# EAGLE schematic tablet (EAGLE 8.4.3)
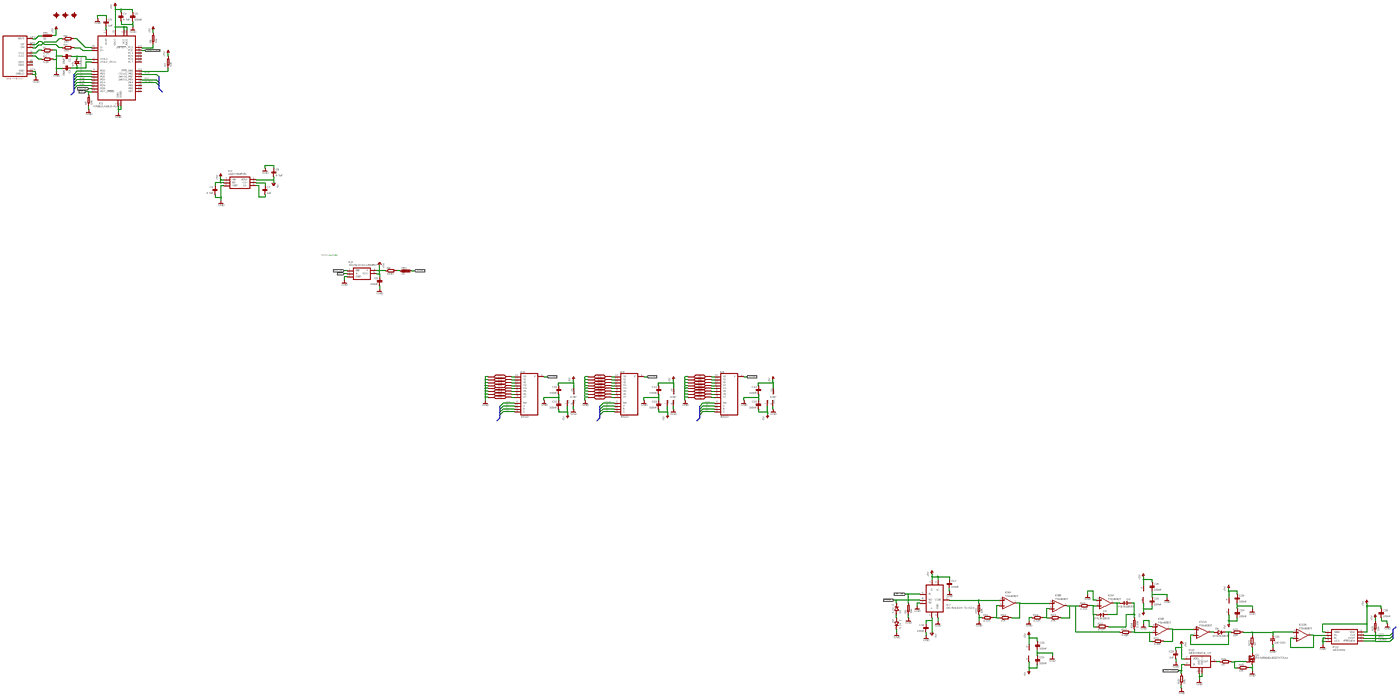
[diagram p0: schematic, sheet 1, overview]
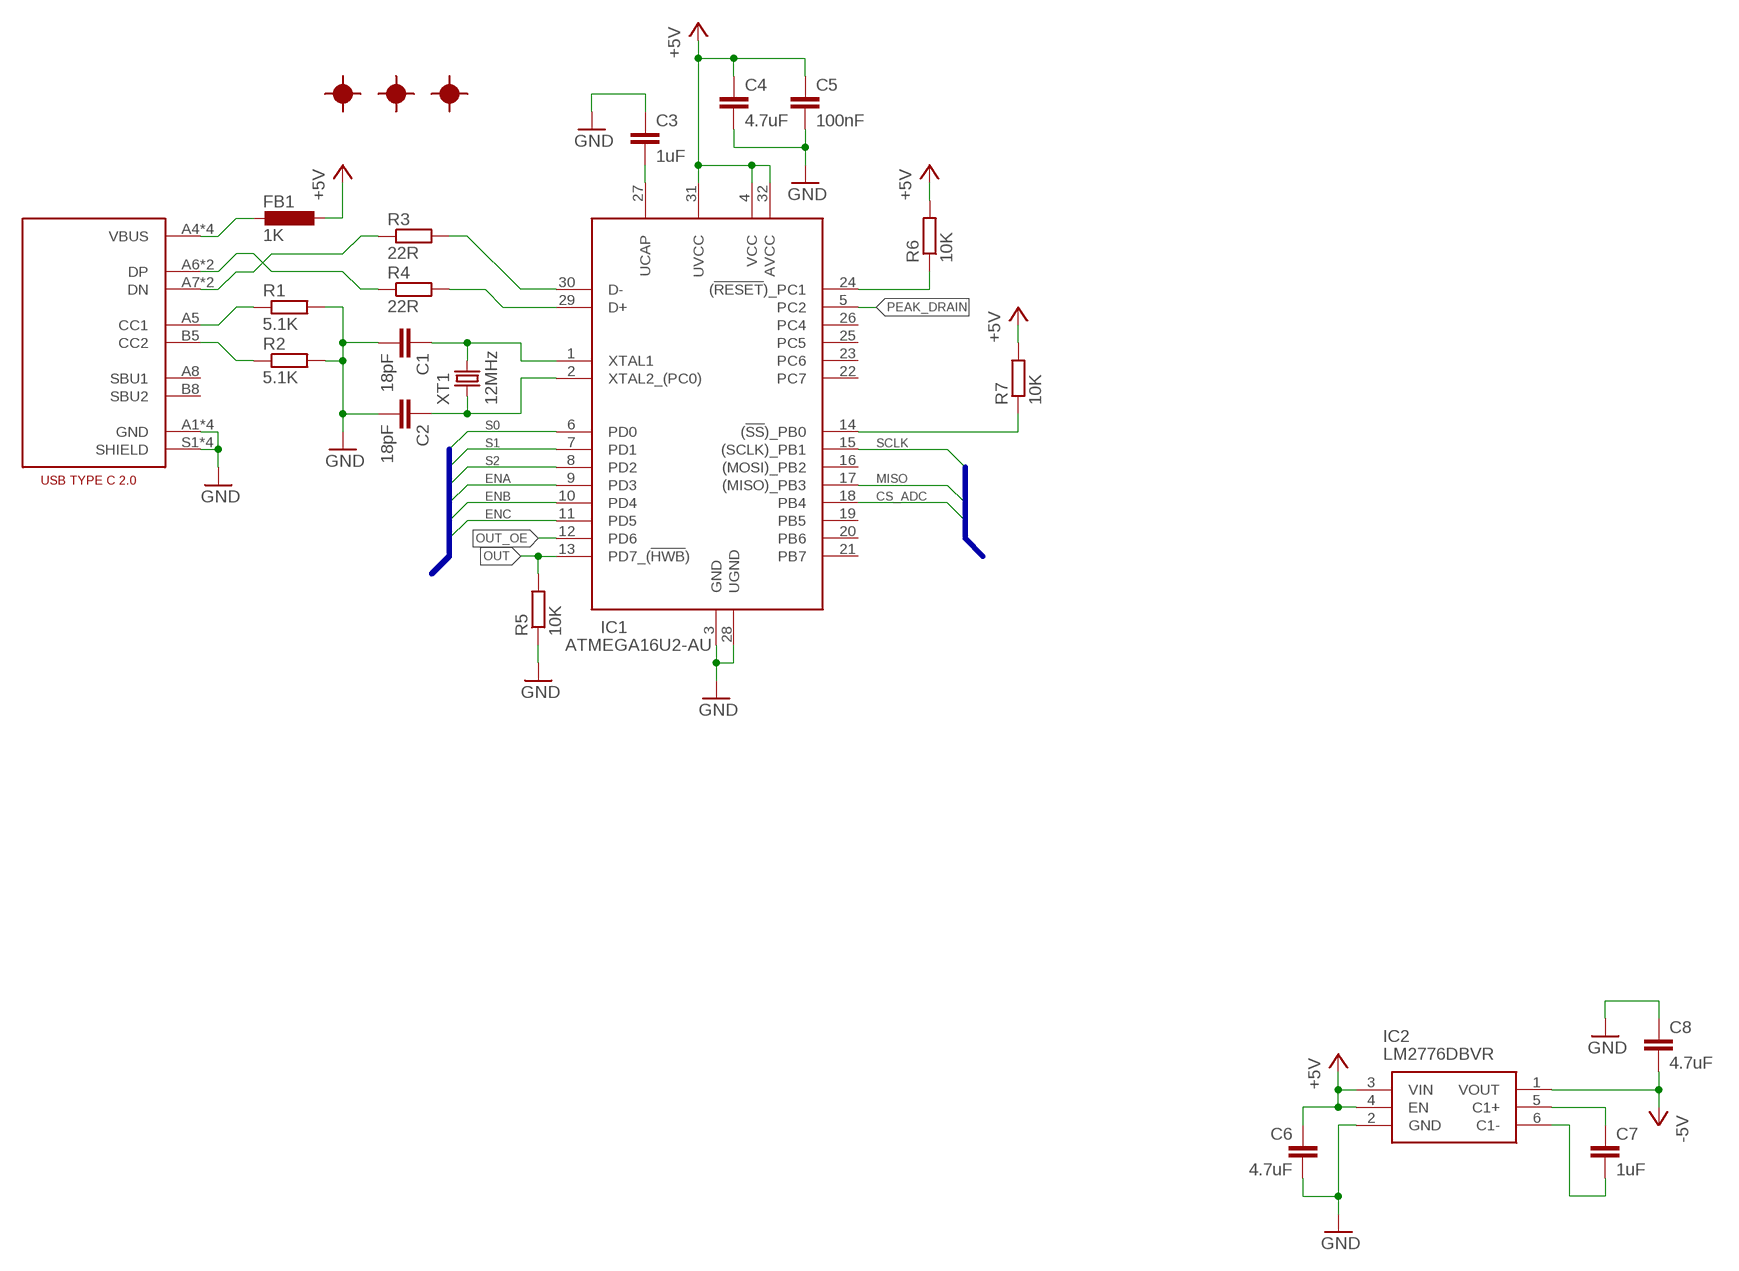
[diagram p1: schematic, sheet 1, part 1 of 4]
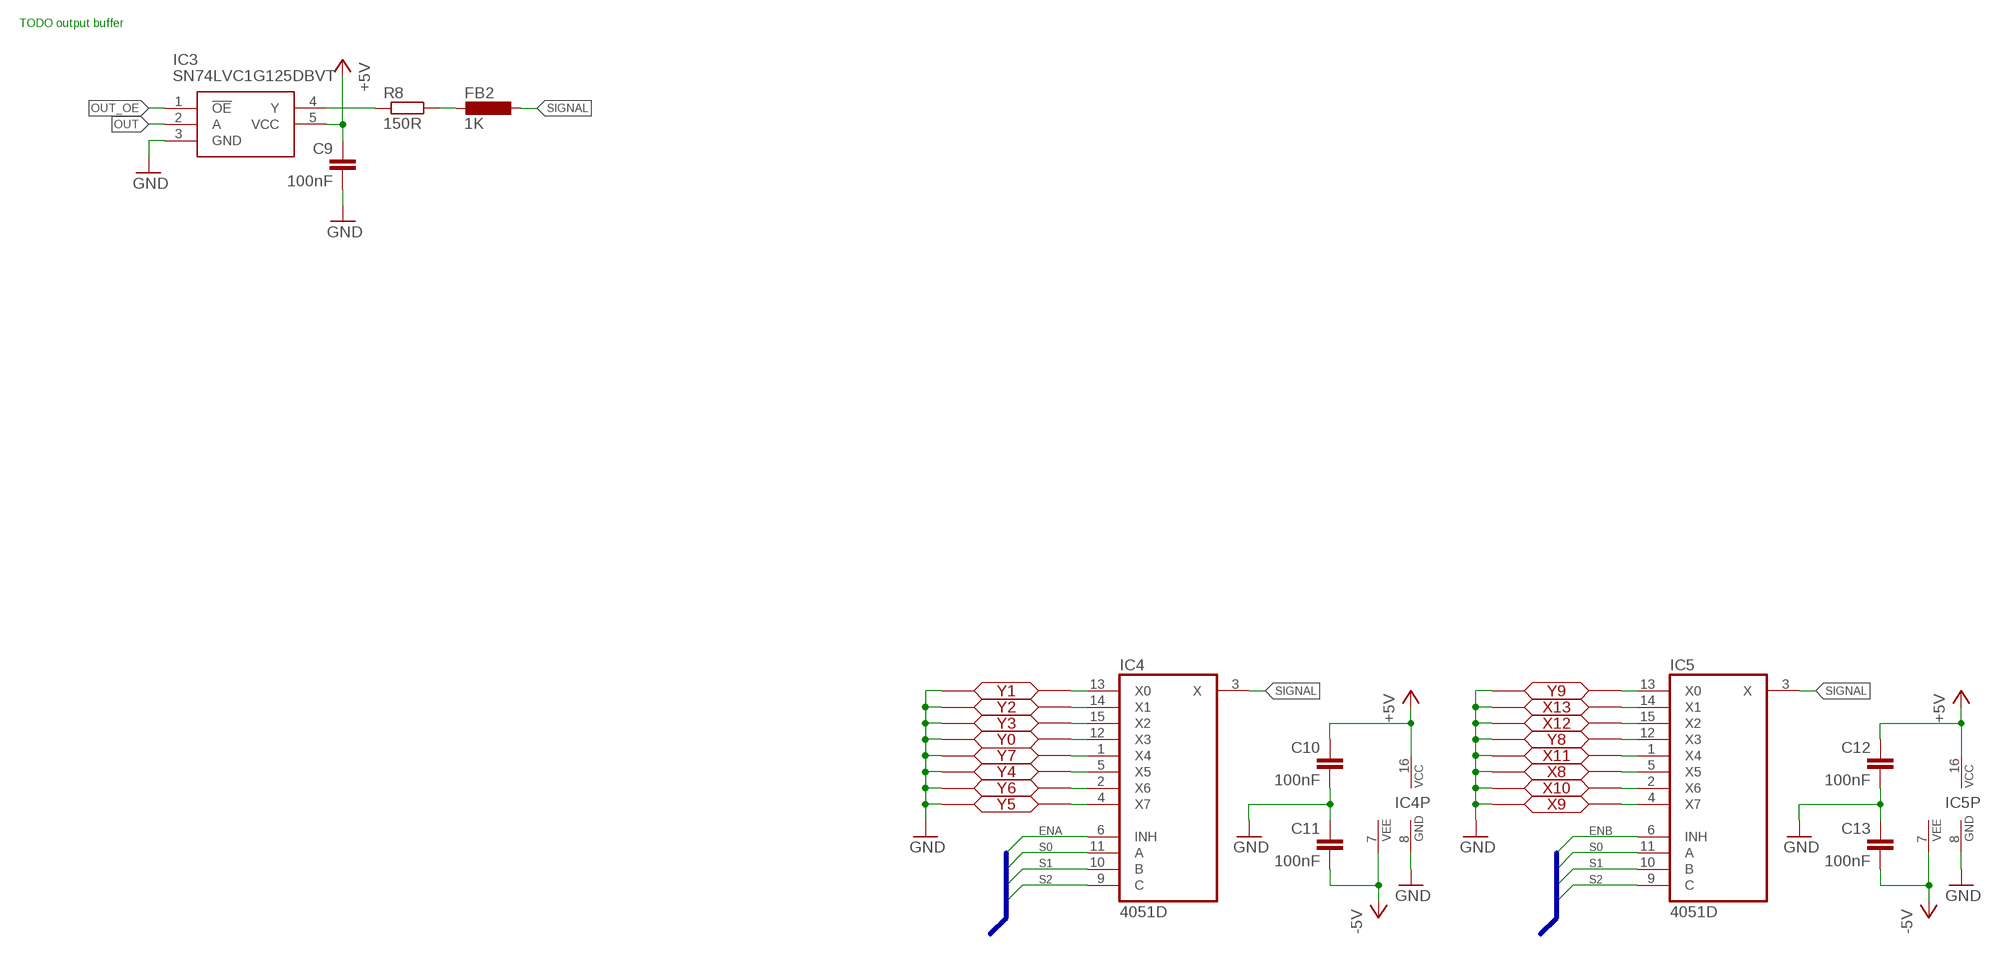
[diagram p2: schematic, sheet 1, part 2 of 4]
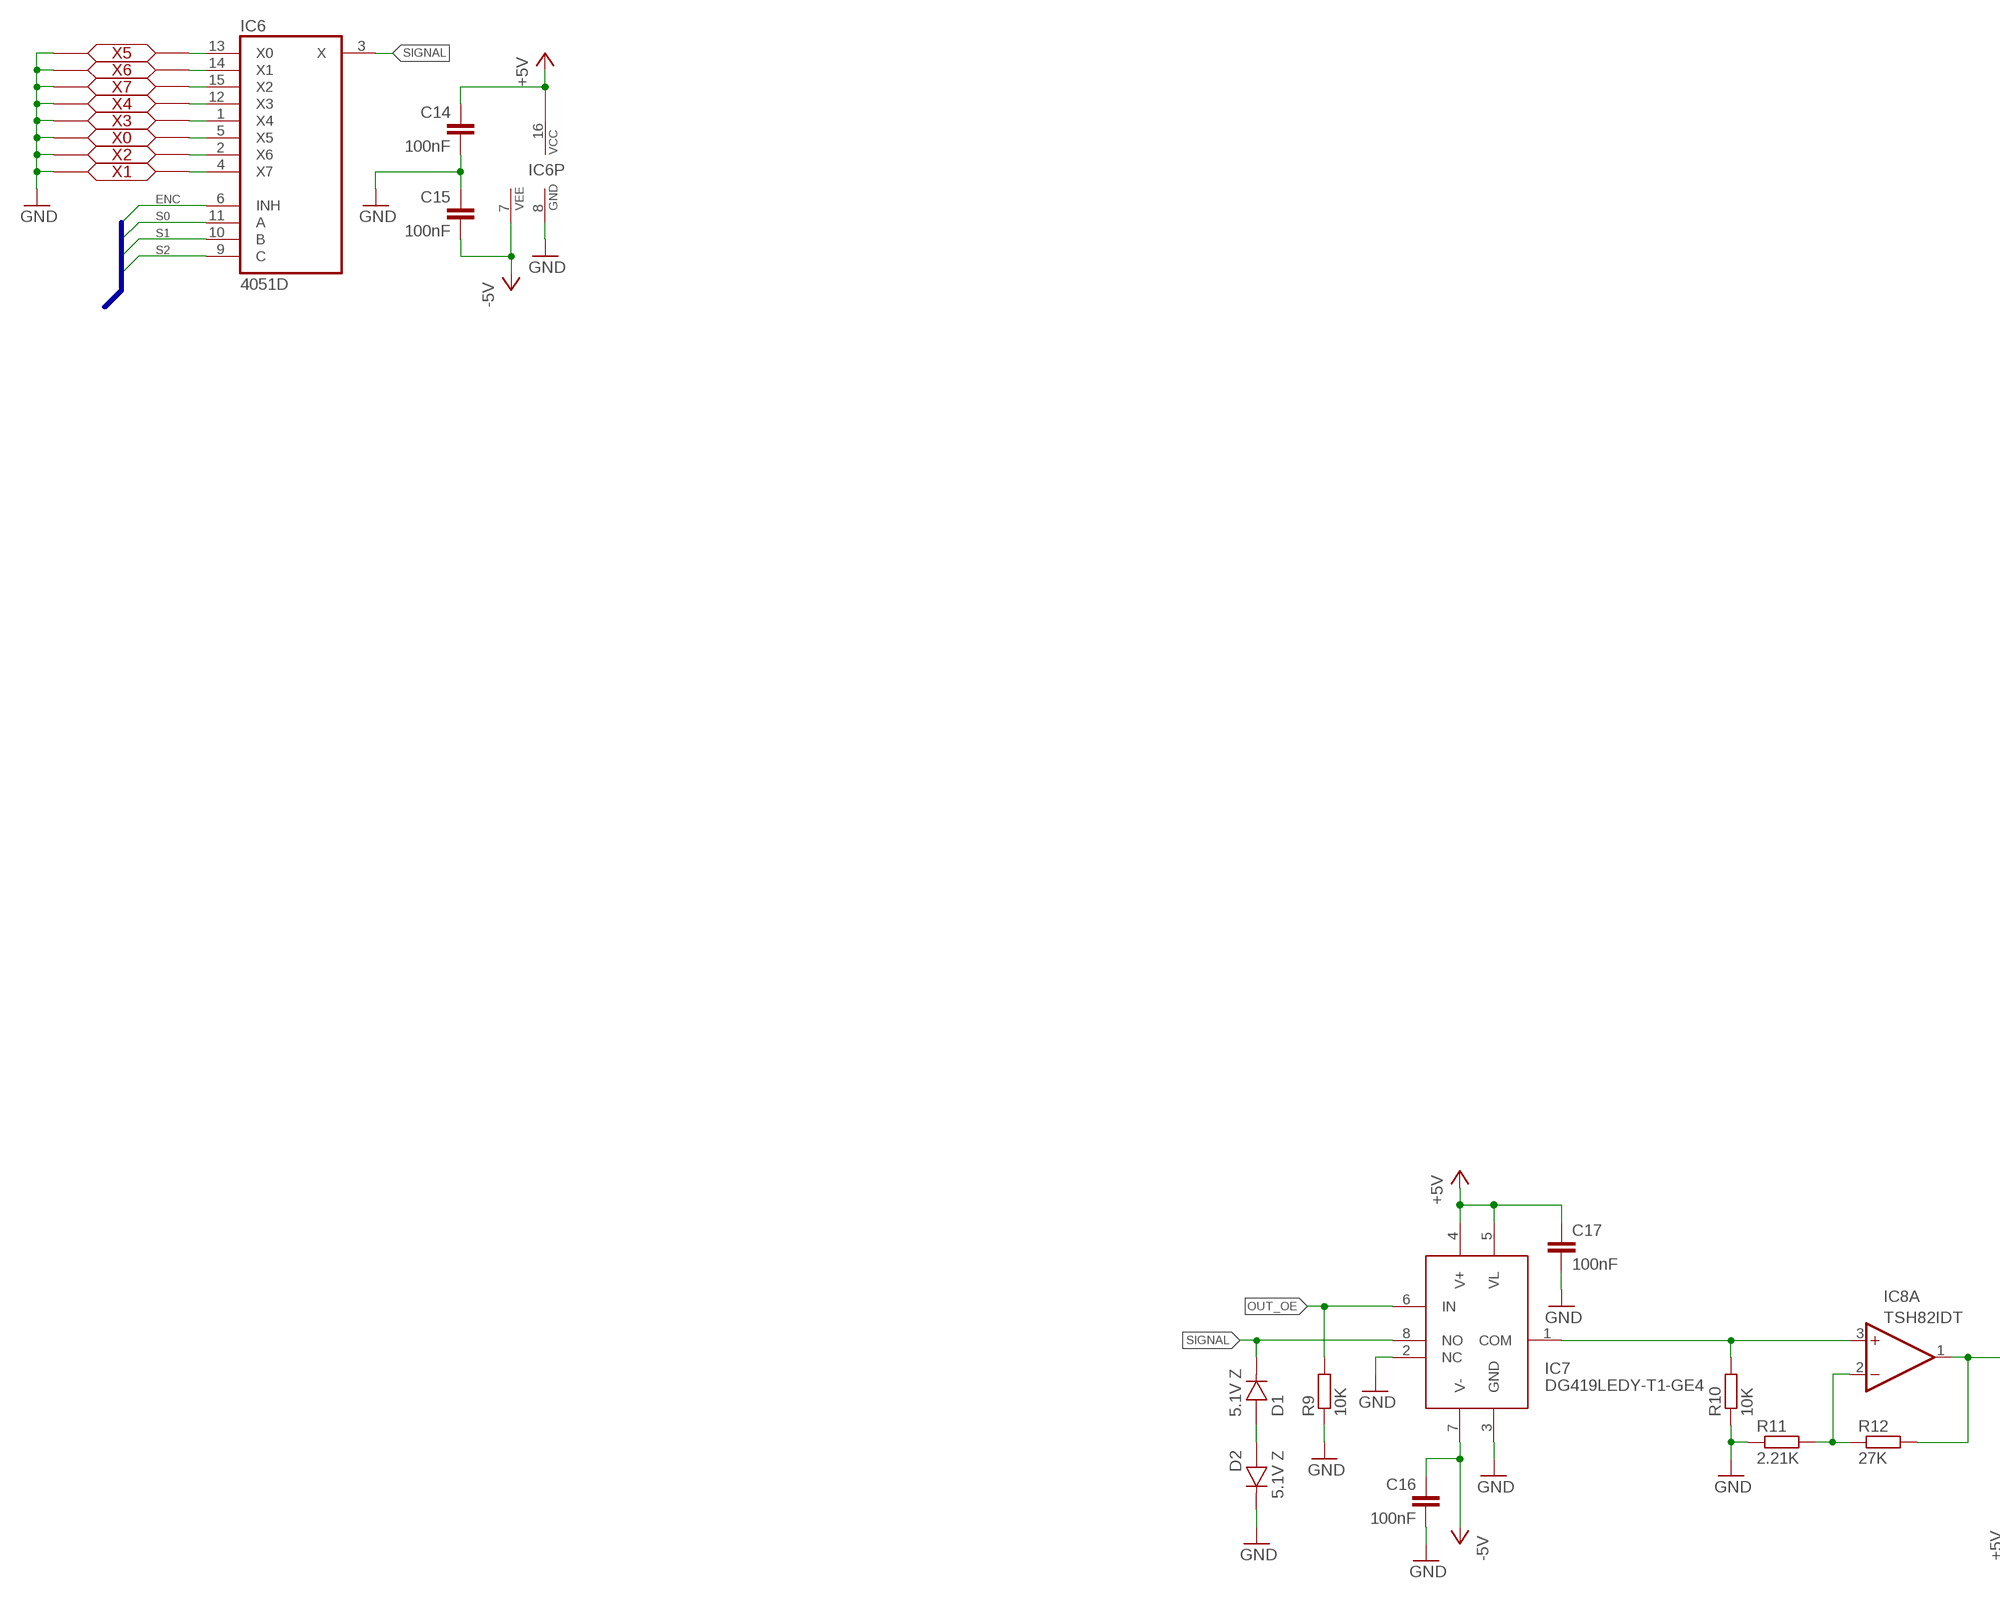
[diagram p3: schematic, sheet 1, part 3 of 4]
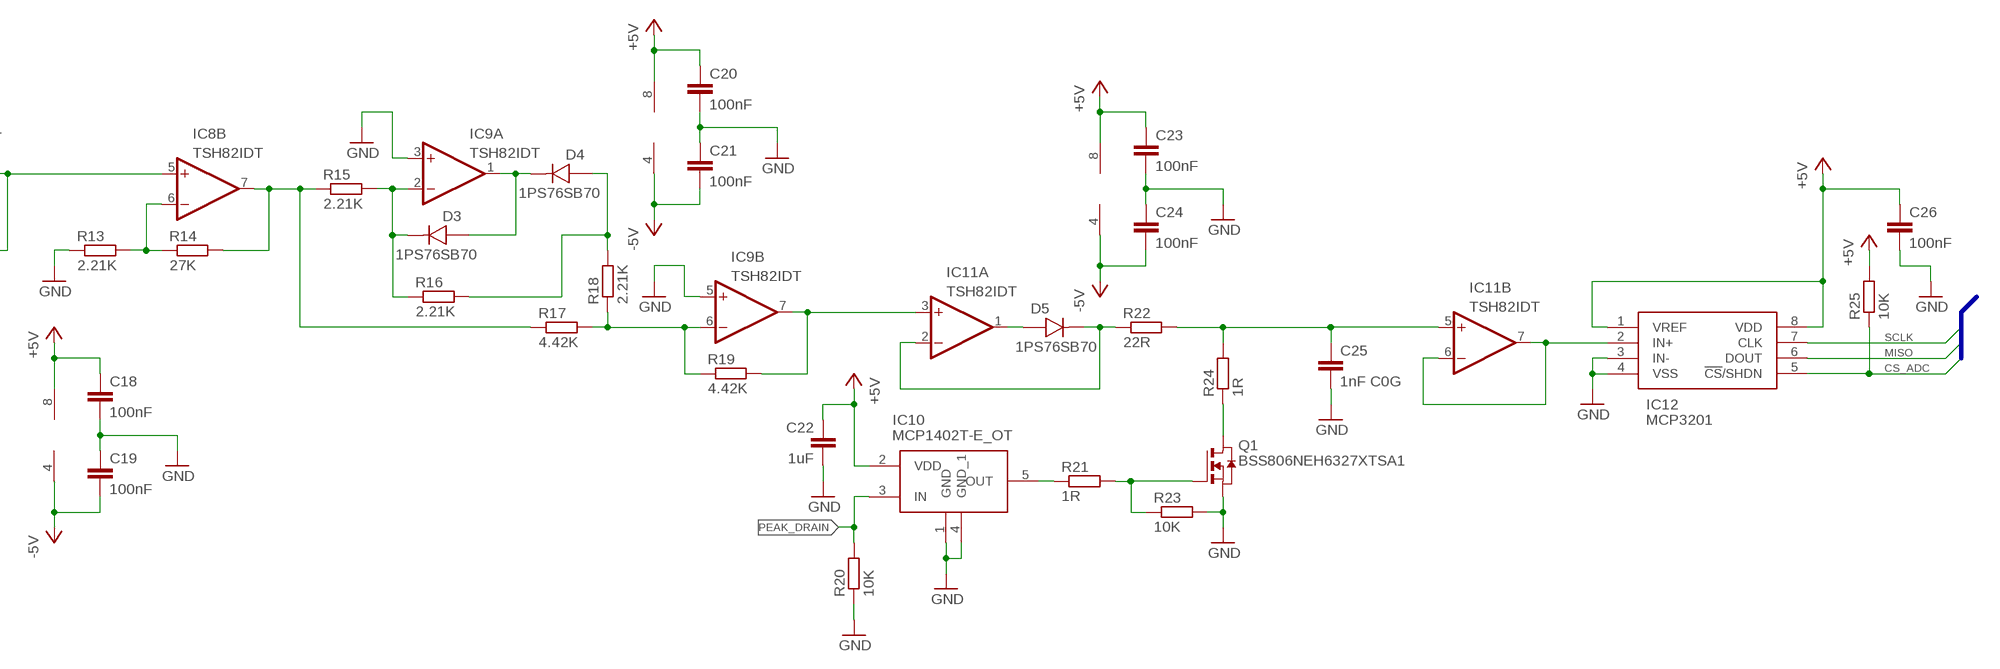
[diagram p4: schematic, sheet 1, part 4 of 4]

## Parts
C1  18pF  C0805  [0805]
C2  18pF  C0805  [0805]
C3  1uF  C0805  [0805]
C4  4.7uF  C0805  [0805]
C5  100nF  C0805  [0805]
C6  4.7uF  C0805  [0805]
C7  1uF  C0805  [0805]
C8  4.7uF  C0805  [0805]
C9  100nF  C0805  [0805]
C10  100nF  C0805  [0805]
C11  100nF  C0805  [0805]
C12  100nF  C0805  [0805]
C13  100nF  C0805  [0805]
C14  100nF  C0805  [0805]
C15  100nF  C0805  [0805]
C16  100nF  C0805  [0805]
C17  100nF  C0805  [0805]
C18  100nF  C0805  [0805]
C19  100nF  C0805  [0805]
C20  100nF  C0805  [0805]
C21  100nF  C0805  [0805]
C22  1uF  C0805  [0805]
C23  100nF  C0805  [0805]
C24  100nF  C0805  [0805]
C25  1nF C0G  C0805  [0805]
C26  100nF  C0805  [0805]
D1  5.1V Z  DSOD323  [SOD323]
D2  5.1V Z  DSOD323  [SOD323]
D3  1PS76SB70  DSOD323  [SOD323]
D4  1PS76SB70  DSOD323  [SOD323]
D5  1PS76SB70  DSOD323  [SOD323]
FB1  1K  FB0805  [0805]
FB2  1K  FB0805  [0805]
FD1  FIDUCIAL1_2  [FIDUCIAL]
FD2  FIDUCIAL1_2  [FIDUCIAL]
FD3  FIDUCIAL1_2  [FIDUCIAL]
IC1  ATMEGA16U2-AU  [QFP80P900X900X120-32N]
IC2  LM2776DBVR  [SOT95P280X145-6N]
IC3  SN74LVC1G125DBVT  [SOT95P280X145-5N]
IC4  4051D  [SO16]
IC5  4051D  [SO16]
IC6  4051D  [SO16]
IC7  DG419LEDY-T1-GE4  [SOIC8]
IC8  TSH82IDT  OPAMPSOIC8  [SOIC8]
IC9  TSH82IDT  OPAMPSOIC8  [SOIC8]
IC10  MCP1402T-E_OT  [SOT95P270X145-5N]
IC11  TSH82IDT  OPAMPSOIC8  [SOIC8]
IC12  MCP3201  [SOIC8]
J1  USB4085-GF-A  [USB4085-GF-A]
Q1  BSS806NEH6327XTSA1  MOSFET_NSOT23_3_GSD  [SOT23_3]
R1  5.1K  R0805  [0805]
R2  5.1K  R0805  [0805]
R3  22R  R0805  [0805]
R4  22R  R0805  [0805]
R5  10K  R0805  [0805]
R6  10K  R0805  [0805]
R7  10K  R0805  [0805]
R8  150R  R0805  [0805]
R9  10K  R0805  [0805]
R10  10K  R0805  [0805]
R11  2.21K  R0805  [0805]
R12  27K  R0805  [0805]
R13  2.21K  R0805  [0805]
R14  27K  R0805  [0805]
R15  2.21K  R0805  [0805]
R16  2.21K  R0805  [0805]
R17  4.42K  R0805  [0805]
R18  2.21K  R0805  [0805]
R19  4.42K  R0805  [0805]
R20  10K  R0805  [0805]
R21  1R  R0805  [0805]
R22  22R  R0805  [0805]
R23  10K  R0805  [0805]
R24  1R  R0805  [0805]
R25  10K  R0805  [0805]
X0  2P  [2P]
X1  2P  [2P]
X2  2P  [2P]
X3  2P  [2P]
X4  2P  [2P]
X5  2P  [2P]
X6  2P  [2P]
X7  2P  [2P]
X8  2P  [2P]
X9  2P  [2P]
X10  2P  [2P]
X11  2P  [2P]
X12  2P  [2P]
X13  2P  [2P]
XT1  12MHz  CRYSTALHC49UP  [HC49UP]
Y0  2P  [2P]
Y1  2P  [2P]
Y2  2P  [2P]
Y3  2P  [2P]
Y4  2P  [2P]
Y5  2P  [2P]
Y6  2P  [2P]
Y7  2P  [2P]
Y8  2P  [2P]
Y9  2P  [2P]

## Nets
+5V: C4.1 C5.1 C6.1 C9.1 C10.1 C12.1 C14.1 C17.1 C18.1 C20.1 C22.1 C23.1 C26.1 FB1.1 IC1.4(VCC) IC1.31(UVCC) IC1.32(AVCC) IC2.3(VIN) IC2.4(EN) IC3.5(VCC) IC4.16(VCC) IC5.16(VCC) IC6.16(VCC) IC7.4(V+) IC7.5(VL) IC8.8(PWR:V+) IC9.8(PWR:V+) IC10.2(VDD) IC11.8(PWR:V+) IC12.1(VREF) IC12.8(VDD) R6.2 R7.2 R25.2
-5V: C8.2 C11.2 C13.2 C15.2 C16.1 C19.2 C21.2 C24.2 IC2.1(VOUT) IC4.7(VEE) IC5.7(VEE) IC6.7(VEE) IC7.7(V-) IC8.4(PWR:V-) IC9.4(PWR:V-) IC11.4(PWR:V-)
CS_ADC: IC1.18(PB4) IC12.5(!CS!/SHDN) R25.1
ENA: IC1.9(PD3) IC4.6(INH)
ENB: IC1.10(PD4) IC5.6(INH)
ENC: IC1.11(PD5) IC6.6(INH)
GND: C1.2 C2.2 C3.1 C4.2 C5.2 C6.2 C8.1 C9.2 C10.2 C11.1 C12.2 C13.1 C14.2 C15.1 C16.2 C17.2 C18.2 C19.1 C20.2 C21.1 C22.2 C23.2 C24.1 C25.2 C26.2 D2.2 IC1.3(GND) IC1.28(UGND) IC2.2(GND) IC3.3(GND) IC4.8(GND) IC5.8(GND) IC6.8(GND) IC7.2(NC) IC7.3(GND) IC9.3(A:+IN) IC9.5(B:+IN) IC10.1(GND) IC10.4(GND_1) IC12.3(IN-) IC12.4(VSS) J1.A1(GND) J1.A12(GND) J1.B1(GND) J1.B12(GND) J1.S1(SHIELD) J1.S2(SHIELD) J1.S3(SHIELD) J1.S4(SHIELD) Q1.P$2(S) R1.2 R2.2 R5.1 R9.1 R10.1 R11.1 R13.1 R20.1 R23.2 X0.2 X1.2 X2.2 X3.2 X4.2 X5.2 X6.2 X7.2 X8.2 X9.2 X10.2 X11.2 X12.2 X13.2 Y0.2 Y1.2 Y2.2 Y3.2 Y4.2 Y5.2 Y6.2 Y7.2 Y8.2 Y9.2
MISO: IC1.17((MISO)_PB3) IC12.6(DOUT)
N$1: C1.1 IC1.1(XTAL1) XT1.2
N$2: D1.1 D2.1
N$3: IC3.4(Y) R8.1
N$4: IC8.2(A:-IN) R11.2 R12.1
N$5: C25.1 IC11.5(B:+IN) R22.2 R24.2
N$6: C3.2 IC1.27(UCAP)
N$7: C2.1 IC1.2(XTAL2_(PC0)) XT1.1
N$8: FB1.2 J1.A4(VBUS) J1.A9(VBUS) J1.B4(VBUS) J1.B9(VBUS)
N$9: IC8.7(B:OUT) R14.2 R15.1 R17.1
N$11: IC8.1(A:OUT) IC8.5(B:+IN) R12.2
N$12: D3.2 IC9.2(A:-IN) R15.2 R16.1
N$13: J1.A5(CC1) R1.1
N$14: IC8.6(B:-IN) R13.2 R14.1
N$15: J1.B5(CC2) R2.1
N$18: D3.1 D4.2 IC9.1(A:OUT)
N$19: D4.1 R16.2 R18.2
N$20: IC9.6(B:-IN) R17.2 R18.1 R19.1
N$22: Q1.P$1(G) R21.2 R23.1
N$23: D5.1 IC11.1(A:OUT)
N$24: IC9.7(B:OUT) IC11.3(A:+IN) R19.2
N$25: D5.2 IC11.2(A:-IN) R22.1
N$26: IC1.14((!SS!)_PB0) R7.1
N$27: IC1.24((!RESET!)_PC1) R6.1
N$28: IC11.6(B:-IN) IC11.7(B:OUT) IC12.2(IN+)
N$29: IC1.29(D+) R4.2
N$30: IC7.1(COM) IC8.3(A:+IN) R10.2
N$31: IC1.30(D-) R3.2
N$32: J1.A7(DN) J1.B7(DN) R3.1
N$33: J1.A6(DP) J1.B6(DP) R4.1
N$34: Q1.P$3(D) R24.1
N$35: IC10.5(OUT) R21.1
N$36: C7.1 IC2.5(C1+)
N$37: C7.2 IC2.6(C1-)
N$39: FB2.2 R8.2
OUT: IC1.13(PD7_(!HWB!)) IC3.2(A) R5.2
OUT_OE: IC1.12(PD6) IC3.1(!OE) IC7.6(IN) R9.2
PEAK_DRAIN: IC1.5(PC2) IC10.3(IN) R20.2
S0: IC1.6(PD0) IC4.11(A) IC5.11(A) IC6.11(A)
S1: IC1.7(PD1) IC4.10(B) IC5.10(B) IC6.10(B)
S2: IC1.8(PD2) IC4.9(C) IC5.9(C) IC6.9(C)
SCLK: IC1.15((SCLK)_PB1) IC12.7(CLK)
SIGNAL: D1.2 FB2.1 IC4.3(X) IC5.3(X) IC6.3(X) IC7.8(NO)
X0 [coil]: IC6.5(X5) X0.1
X1 [coil]: IC6.4(X7) X1.1
X2 [coil]: IC6.2(X6) X2.1
X3 [coil]: IC6.1(X4) X3.1
X4 [coil]: IC6.12(X3) X4.1
X5 [coil]: IC6.13(X0) X5.1
X6 [coil]: IC6.14(X1) X6.1
X7 [coil]: IC6.15(X2) X7.1
X8 [coil]: IC5.5(X5) X8.1
X9 [coil]: IC5.4(X7) X9.1
X10 [coil]: IC5.2(X6) X10.1
X11 [coil]: IC5.1(X4) X11.1
X12 [coil]: IC5.15(X2) X12.1
X13 [coil]: IC5.14(X1) X13.1
Y0 [coil]: IC4.12(X3) Y0.1
Y1 [coil]: IC4.13(X0) Y1.1
Y2 [coil]: IC4.14(X1) Y2.1
Y3 [coil]: IC4.15(X2) Y3.1
Y4 [coil]: IC4.5(X5) Y4.1
Y5 [coil]: IC4.4(X7) Y5.1
Y6 [coil]: IC4.2(X6) Y6.1
Y7 [coil]: IC4.1(X4) Y7.1
Y8 [coil]: IC5.12(X3) Y8.1
Y9 [coil]: IC5.13(X0) Y9.1
Unconnected: IC1.16((MOSI)_PB2) IC1.19(PB5) IC1.20(PB6) IC1.21(PB7) IC1.22(PC7) IC1.23(PC6) IC1.25(PC5) IC1.26(PC4) J1.A8(SBU1) J1.B8(SBU2)

## Buses
SCLK,MISO,CS_ADC
S0,S1,S2,ENA,ENB,ENC

## Notes on the sheet
- TODO output buffer

## Library data of the parts
C1-C26 = 0jpe:C
D1-D5 = 0jpe:D
FB1 FB2 = 0jpe:FB
FD1-FD3 = 0jpe:FIDUCIAL
IC1 = ATMEGA16U2-AU:ATMEGA16U2-AU: ATMEGA16U2-AU, 8 bit AVR Microcontroller 16MHz 16 kB, 512 B Flash, 512 B RAM, USB 32-Pin TQFP Source: Datasheet <http://www.atmel.com/images/doc7799.pdf>; DESCRIPTION: ATMEGA16U2-AU, 8 bit AVR Microcontroller 16MHz 16 kB, 512 B Flash, 512 B RAM, USB 32-Pin TQFP; HEIGHT: 1.2mm; MANUFACTURER_NAME: Microchip; MANUFACTURER_PART_NUMBER: ATMEGA16U2-AU; MOUSER_PART_NUMBER: 556-ATMEGA16U2-AU; MOUSER_PRICE-STOCK: https://www.mouser.com/Search/Refine.aspx?Keyword=556-ATMEGA16U2-AU; RS_PART_NUMBER: 1278282P; RS_PRICE-STOCK: http://uk.rs-online.com/web/p/products/1278282P
IC2 = LM2776DBVR:LM2776DBVR: Switched Capacitor Inverter Source: Datasheet <http://www.ti.com/lit/gpn/lm2776>; ARROW_PART_NUMBER: LM2776DBVR; ARROW_PRICE-STOCK: https://www.arrow.com/en/products/lm2776dbvr/texas-instruments; DESCRIPTION: Switched Capacitor Inverter; HEIGHT: 1.45mm; MANUFACTURER_NAME: Texas Instruments; MANUFACTURER_PART_NUMBER: LM2776DBVR; MOUSER_PART_NUMBER: 595-LM2776DBVR; MOUSER_PRICE-STOCK: https://www.mouser.co.uk/ProductDetail/Texas-Instruments/LM2776DBVR?qs=GJ%2F2ZGcr5uNWFBSWrQXDWw%3D%3D
IC3 = SN74LVC1G125DBVT:SN74LVC1G125DBVT: Single Bus Buffer Gate With 3-State Outputs Source: Datasheet <http://www.ti.com/lit/gpn/sn74lvc1g125>; ARROW_PART_NUMBER: SN74LVC1G125DBVT; ARROW_PRICE-STOCK: https://www.arrow.com/en/products/sn74lvc1g125dbvt/texas-instruments; DESCRIPTION: Single Bus Buffer Gate With 3-State Outputs; HEIGHT: 1.45mm; MANUFACTURER_NAME: Texas Instruments; MANUFACTURER_PART_NUMBER: SN74LVC1G125DBVT; MOUSER_PART_NUMBER: 595-SN74LVC1G125DBVT; MOUSER_PRICE-STOCK: https://www.mouser.co.uk/ProductDetail/Texas-Instruments/SN74LVC1G125DBVT?qs=pajgIaoyDUhgzq%252B7Owiehg%3D%3D
IC4-IC6 = 40xx:4051: 8-channel ANALOG MULTIPLEXER
IC7 = 0jpe:DG419LEDY-T1-GE4
IC8 IC9 IC11 = 0jpe:OPAMP
IC10 = MCP1402T-E_OT:MCP1402T-E_OT: MOSFET Driver 0.5A High-Speed 18V SOT23 Source: Datasheet <http://docs-emea.rs-online.com/webdocs/0d0d/0900766b80d0d3af.pdf>; ARROW_PART_NUMBER: MCP1402T-E/OT; ARROW_PRICE-STOCK: https://www.arrow.com/en/products/mcp1402t-eot/microchip-technology; DESCRIPTION: MOSFET Driver 0.5A High-Speed 18V SOT23; HEIGHT: 1.45mm; MANUFACTURER_NAME: Microchip; MANUFACTURER_PART_NUMBER: MCP1402T-E/OT; MOUSER_PART_NUMBER: 579-MCP1402T-E/OT; MOUSER_PRICE-STOCK: https://www.mouser.com/Search/Refine.aspx?Keyword=579-MCP1402T-E%2FOT
IC12 = 0jpe:MCP3201
J1 = usb4085:USB4085-GF-A
Q1 = 0jpe:MOSFET_N
R1-R25 = 0jpe:R
X0 X1-X13 Y0 Y1-Y9 = 2p:2P
XT1 = crystal:CRYSTAL: CRYSTAL; OC_FARNELL: unknown; OC_NEWARK: unknown

## Net classes
0 default: width 0.152 mm, clearance 0.152 mm
1 coil: width 0.127 mm, clearance 0.127 mm